# EAGLE design comms_sys_schematic_V2 (EAGLE 9.5.2)
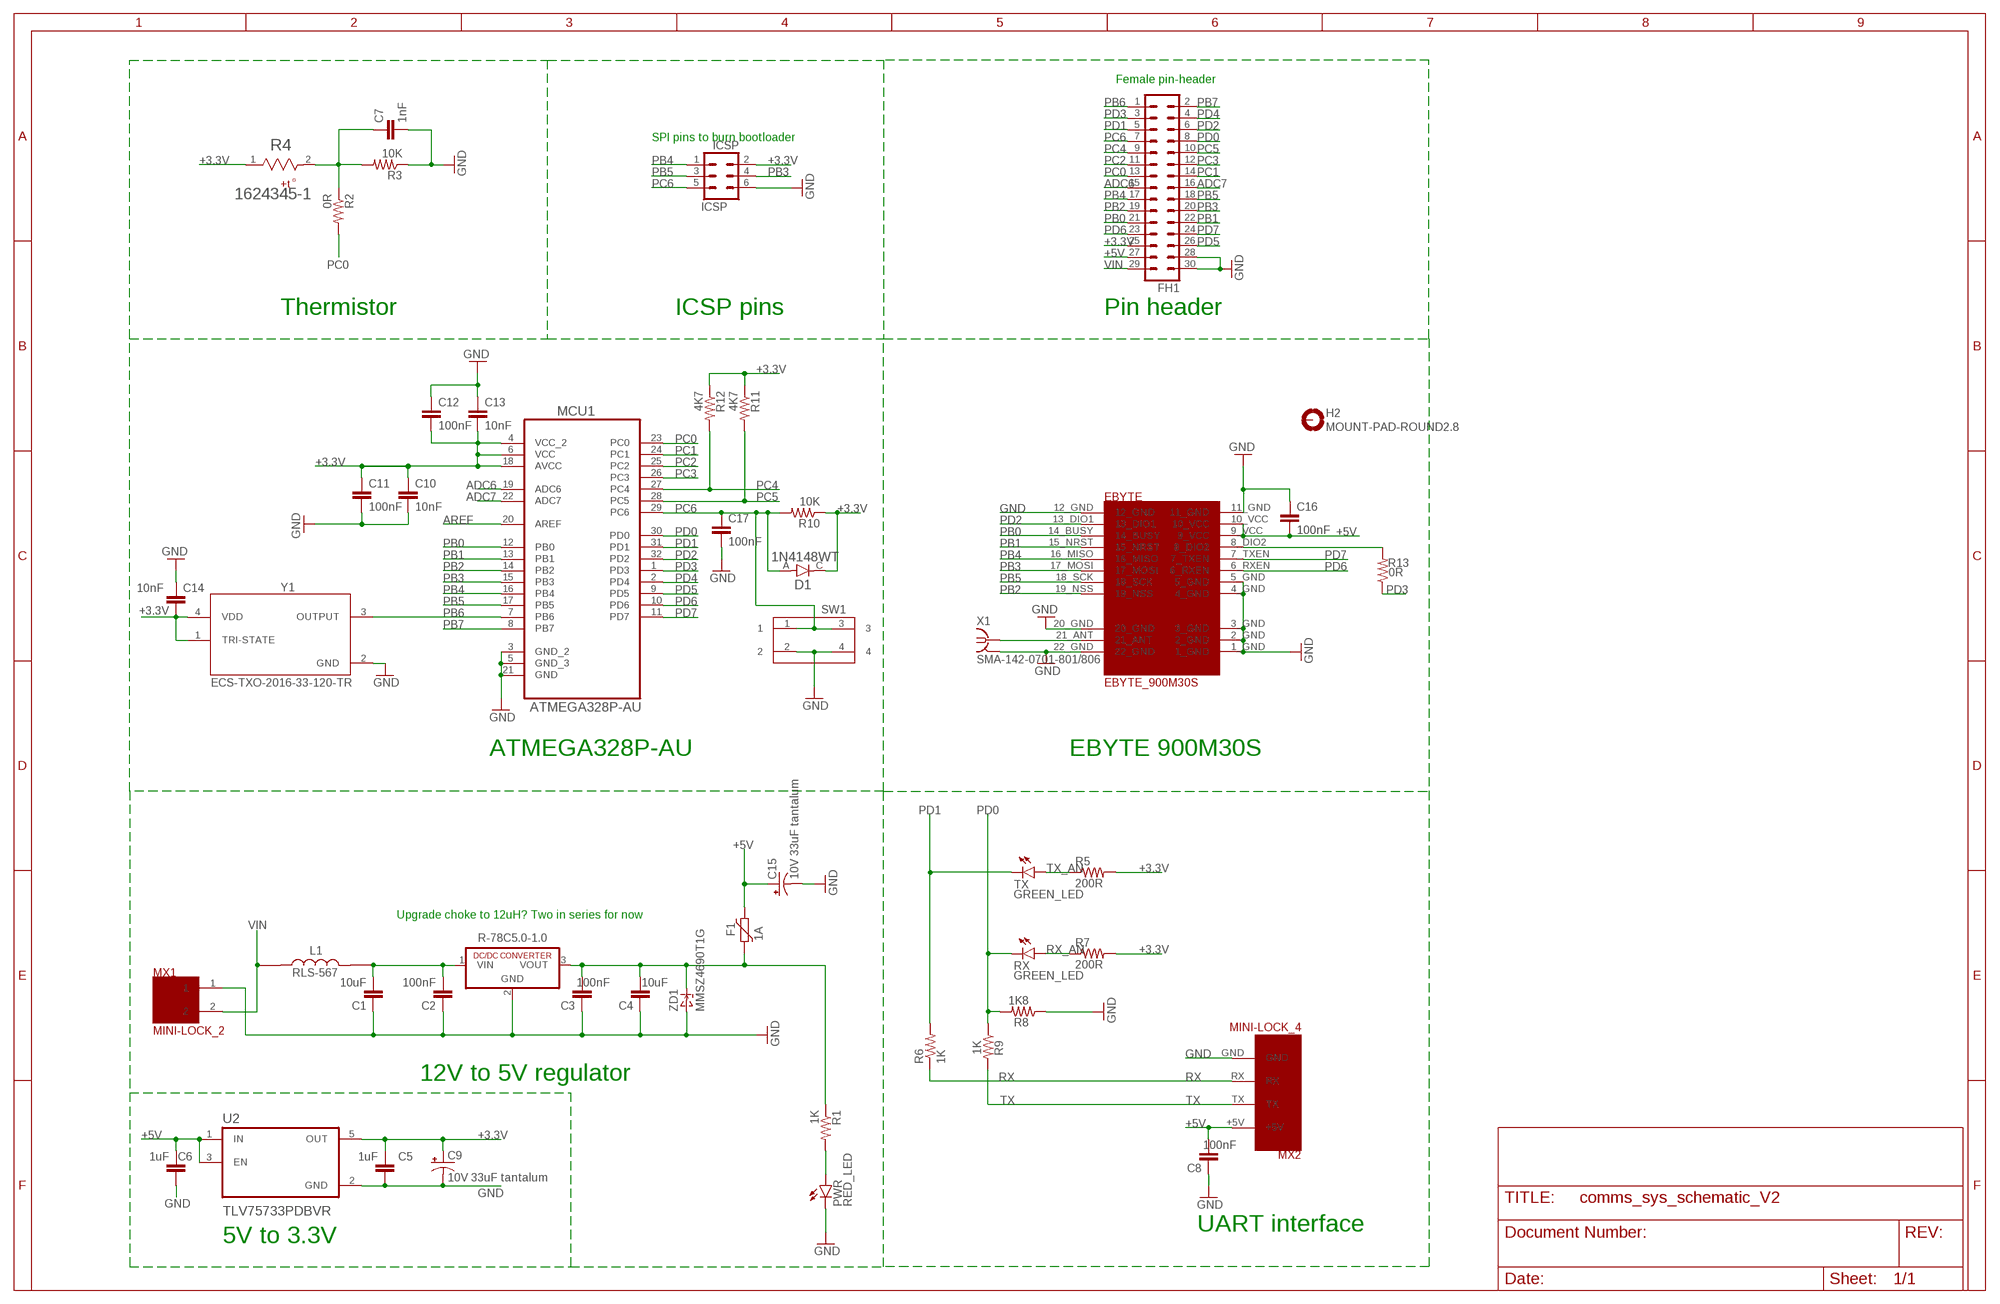
[diagram p0: schematic, sheet 1]

## Parts
C1  10uF  C-EUC0805  [C0805]
C2  100nF  C-EUC0805  [C0805]
C3  100nF  C-EUC0805  [C0805]
C4  10uF  C-EUC0805  [C0805]
C5  1uF  C-EUC0805  [C0805]
C6  1uF  C-EUC0805  [C0805]
C7  1nF  C-EUC0805  [C0805]
C8  100nF  C-EUC0805  [C0805]
C9  10V 33uF tantalum  CPOL-USCT3216  [CT3216]
C10  10nF  C-EUC0805  [C0805]
C11  100nF  C-EUC0805  [C0805]
C12  100nF  C-EUC0805  [C0805]
C13  10nF  C-EUC0805  [C0805]
C14  10nF  C-EUC0805  [C0805]
C15  10V 33uF tantalum  CPOL-USCT3216  [CT3216]
C16  100nF  C-EUC0805  [C0805]
C17  100nF  C-EUC0805  [C0805]
D1  1N4148WT  [SODFL1608X70N]
EBYTE  EBYTE_900M30S  EBYTE_SX1262_900M30S  [EBYTE_SX1262_900M30S_FOOTPRINT]
F1  1A  FUSE_PTC-0805  [PTC0805]
FH1  MA15-2  [MA15-2]
H2  MOUNT-PAD-ROUND2.8  [2,8-PAD]
ICSP  ICSP  MA03-2  [MA03-2]
L1  RLS-567  [IND_RLS-567]
MCU1  ATMEGA328P-AU  [QFP80P900X900X120-32N]
MX1  MINI-LOCK_2  [MINI-LOCK_2]
MX2  MINI-LOCK_4  [MINI-LOCK_4]
PWR  RED_LED  LEDCHIP-LED0805  [CHIP-LED0805]
R1  1K  R-US_R0805  [R0805]
R2  0R  R-US_R0805  [R0805]
R3  10K  R-US_R0805  [R0805]
R4  1624345-1  [THRMC2012X50N]
R5  200R  R-US_R0805  [R0805]
R6  1K  R-US_R0805  [R0805]
R7  200R  R-US_R0805  [R0805]
R8  1K8  R-US_R0805  [R0805]
R9  1K  R-US_R0805  [R0805]
R10  10K  R-US_R0805  [R0805]
R11  4K7  R-US_R0805  [R0805]
R12  4K7  R-US_R0805  [R0805]
R13  0R  R-US_R0805  [R0805]
RX  GREEN_LED  LEDCHIP-LED0805  [CHIP-LED0805]
SW1  430152043826  [430152043826]
TX  GREEN_LED  LEDCHIP-LED0805  [CHIP-LED0805]
U1  R-78C5.0-1.0  [SIP3]
U2  TLV75733PDBVR  [SOT95P280X145-5N]
X1  SMA-142-0701-801/806  [J502-ND-142-0701-801/806]
Y1  ECS-TXO-2016-33-120-TR  [OSC_ECS-TXO-2016-33-120-TR]
ZD1  MMSZ4690T1G  ZENERSOD-123  [SOD-123]

## Nets
$N77: C7.1 R2.1 R3.2 R4.2
+3.3V: C5.2 C9.+ C10.1 C11.1 C12.2 C13.2 C14.2 D1.C FH1.25 ICSP.2 MCU1.4(VCC_2) MCU1.6(VCC) MCU1.18(AVCC) R4.1 R5.2 R7.2 R10.1 R11.1 R12.1 U2.5(OUT) Y1.1(TRI-STATE) Y1.4(VDD)
+5V: C6.2 C8.2 C15.+ C16.2 EBYTE.9_VCC EBYTE.10_VCC F1.2 FH1.27 MX2.+5V U2.1(IN) U2.3(EN)
ADC6: FH1.15 MCU1.19(ADC6)
ADC7: FH1.16 MCU1.22(ADC7)
AREF: MCU1.20(AREF)
GND: C1.1 C2.1 C3.1 C4.1 C5.1 C6.1 C7.2 C8.1 C9.- C10.2 C11.2 C12.1 C13.1 C14.1 C15.- C16.1 C17.2 EBYTE.1_GND EBYTE.2_GND EBYTE.3_GND EBYTE.4_GND EBYTE.5_GND EBYTE.11_GND EBYTE.12_GND EBYTE.20_GND EBYTE.22_GND FH1.28 FH1.30 ICSP.6 MCU1.3(GND_2) MCU1.5(GND_3) MCU1.21(GND) MX1.1 MX2.GND PWR.C R3.1 R8.1 SW1.2 SW1.4 U1.2(GND) U2.2(GND) X1.G@1 X1.G@2 X1.G@3 X1.G@4 Y1.2(GND) ZD1.A
N$1: C3.2 C4.2 F1.1 R1.1 U1.3(VOUT) ZD1.C
N$3: EBYTE.8_DIO2 R13.2
N$4: PWR.A R1.2
N$8: EBYTE.21_ANT X1.1
N$27: C1.2 C2.2 L1.2 U1.1(VIN)
PB0: EBYTE.14_BUSY FH1.21 MCU1.12(PB0)
PB1: EBYTE.15_NRST FH1.22 MCU1.13(PB1)
PB2: EBYTE.19_NSS FH1.19 MCU1.14(PB2)
PB3: EBYTE.17_MOSI FH1.20 ICSP.4 MCU1.15(PB3)
PB4: EBYTE.16_MISO FH1.17 ICSP.1 MCU1.16(PB4)
PB5 [SCK]: EBYTE.18_SCK FH1.18 ICSP.3 MCU1.17(PB5)
PB6: FH1.1 MCU1.7(PB6) Y1.3(OUTPUT)
PB7: FH1.2 MCU1.8(PB7)
PC0: FH1.13 MCU1.23(PC0) R2.2
PC1: FH1.14 MCU1.24(PC1)
PC2: FH1.11 MCU1.25(PC2)
PC3: FH1.12 MCU1.26(PC3)
PC4: FH1.9 MCU1.27(PC4) R12.2
PC5: FH1.10 MCU1.28(PC5) R11.2
PC6: C17.1 D1.A FH1.7 ICSP.5 MCU1.29(PC6) R10.2 SW1.1 SW1.3
PD0: FH1.8 MCU1.30(PD0) R8.2 R9.1 RX.C
PD1: FH1.5 MCU1.31(PD1) R6.2 TX.C
PD2: EBYTE.13_DIO1 FH1.6 MCU1.32(PD2)
PD3: FH1.3 MCU1.1(PD3) R13.1
PD4: FH1.4 MCU1.2(PD4)
PD5: FH1.26 MCU1.9(PD5)
PD6: EBYTE.6_RXEN FH1.23 MCU1.10(PD6)
PD7: EBYTE.7_TXEN FH1.24 MCU1.11(PD7)
RX: MX2.RX R6.1
RX_AN: R7.1 RX.A
TX: MX2.TX R9.2
TX_AN: R5.1 TX.A
VIN: FH1.29 L1.1 MX1.2
Unconnected: H2.B2,8(MOUNT)

## Notes on the sheet
- Female pin-header
- SPI pins to burn bootloader
- Thermistor | ICSP pins | Pin header
- ATMEGA328P-AU | EBYTE 900M30S
- Upgrade choke to 12uH? Two in series for now
- 12V to 5V regulator
- UART interface
- 5V to 3.3V

## Library data of the parts
C1-C8 C10-C14 C16 C17 = rcl:C-EU: CAPACITOR, European symbol; SPICEPREFIX: C
C9 C15 = rcl:CPOL-US: POLARIZED CAPACITOR, American symbol; SPICEPREFIX: C
D1 = 1N4148WT:1N4148WT: Diode Switching 100V 0.125A 2-Pin SOD-523; DESCRIPTION: Diode Standard 75V 200mA Surface Mount SOD-523F; DIGI-KEY_PART_NUMBER: 1N4148WTCT-ND; MF: ON Semiconductor; MP: 1N4148WT; PACKAGE: SOD-523-2 ON Semiconductor; PURCHASE-URL: https://pricing.snapeda.com/search/part/1N4148WT/?ref=eda
EBYTE = cust_parts:EBYTE_SX1262_900M30S
F1 = dp_devices.v6:FUSE_PTC: Resettable PTC
FH1 = con-lstb:MA15-2: PIN HEADER
H2 = holes:MOUNT-PAD-ROUND: MOUNTING PAD, round
ICSP = con-lstb:MA03-2: PIN HEADER; OC_FARNELL: unknown; OC_NEWARK: unknown
L1 = RLS-567:RLS-567: Line Inductors for RECOM Power Supply; AVAILABILITY: Unavailable; DESCRIPTION: Line Inductors for RECOM Power Supply; DIGIKEY-PURCHASE-URL: https://snapeda.com/shop?store=DigiKey&id=3641543; MF: Recom Power; MP: RLS-567; PACKAGE: 1812 Recom Power; PRICE: None
MCU1 = Atmel_By_element14_Batch_1-00:ATMEGA328P-AU: 8-bit Microcontroller with In-System Programmable Flash; MPN: ATMEGA328P-AU; OC_FARNELL: 1715486; OC_NEWARK: 14R4631; PACKAGE: TQFP-32; SUPPLIER: Atmel
MX1 = cust_parts:MINI-LOCK_2
MX2 = cust_parts:MINI-LOCK_4
PWR RX TX = led:LED: LED OSRAM: - CHIPLED LG R971, LG N971, LY N971, LG Q971, LY Q971, LO R971, LY R971 LH N974, LH R974 LS Q976, LO Q976, LY Q976 LO Q996 - Hyper CHIPLED LW Q18S LB Q993, LB Q99A, LB R99A - SideLED LS A670, LO A670, LY A670, LG A670, LP A670 LB A673, LV A673, LT A673, LW A673 LH A674 LY A675 LS A676, LA A676, LO A676, LY A676, LW A676 LS A679, LY A679, LG A679 - Hyper Micro SIDELED® LS Y876, LA Y876, LO Y876, LY Y876 LT Y87S - SmartLED LW L88C, LW L88S LB L89C, LB L89S, LG L890 LS L89K, LO L89K, LY L89K LS L896, LA L896, LO L896, LY L896 - TOPLED LS T670, LO T670, LY T670, LG T670, LP T670 LSG T670, LSP T670, LSY T670, LOP T670, LYG T670 LG T671, LOG T671, LSG T671 LB T673, LV T673, LT T673, LW T673 LH T674 LS T676, LA T676, LO T676, LY T676, LB T676, LH T676, LSB T676, LW T676 LB T67C, LV T67C, LT T67C, LS T67K, LO T67K, LY T67K, LW E67C LS E67B, LA E67B, LO E67B, LY E67B, LB E67C, LV E67C, LT E67C LW T67C LS T679, LY T679, LG T679 LS T770, LO T770, LY T770, LG T770, LP T770 LB T773, LV T773, LT T773, LW T773 LH T774 LS E675, LA E675, LY E675, LS T675 LS T776, LA T776, LO T776, LY T776, LB T776 LHGB T686 LT T68C, LB T68C - Hyper Mini TOPLED® LB M676 - Mini TOPLED Santana® LG M470 LS M47K, LO M47K, LY M47K Source: http://www.osram.convergy.de LUXEON: - LUMILED® LXK2-PW12-R00, LXK2-PW12-S00, LXK2-PW14-U00, LXK2-PW14-V00 LXK2-PM12-R00, LXK2-PM12-S00, LXK2-PM14-U00 LXK2-PE12-Q00, LXK2-PE12-R00, LXK2-PE12-S00, LXK2-PE14-T00, LXK2-PE14-U00 LXK2-PB12-K00, LXK2-PB12-L00, LXK2-PB12-M00, LXK2-PB14-N00, LXK2-PB14-P00, LXK2-PB14-Q00 LXK2-PR12-L00, LXK2-PR12-M00, LXK2-PR14-Q00, LXK2-PR14-R00 LXK2-PD12-Q00, LXK2-PD12-R00, LXK2-PD12-S00 LXK2-PH12-R00, LXK2-PH12-S00 LXK2-PL12-P00, LXK2-PL12-Q00, LXK2-PL12-R00 Source: www.luxeon.com KINGBRIGHT: KA-3528ASYC Source: www.kingbright.com
R1-R3 R5-R13 = rcl:R-US_: RESISTOR, American symbol; SPICEPREFIX: R
R4 = 1624345-1:1624345-1: NTC0805 5% 10K; COMMENT: 1624345-1; DESCRIPTION: Thermistor NTC 10K Ohm 5% 2-Pin 0805 Surface Mount Solder Pad 4100K T/R; DIGI-KEY_PART_NUMBER: A106104CT-ND; MF: TE Connectivity; MP: NTC0805J10K; PACKAGE: 0805 TE Connectivity; PURCHASE-URL: https://pricing.snapeda.com/search/part/NTC0805J10K/?ref=eda
SW1 = Wurth_Elektronik_Electromechanic_Switch_rev16c:430152043826: 6x6 mm SMD WS-TASV <http://katalog.we-online.de/media/images/v2/Family_WS-TASV_6x6mm_SMD_Tact_Switch_4301820xx8xx.jpg> Details see: http://katalog.we-online.de/en/em/TASV_6X6_SMD 2015 (C) Würth Elektronik
U1 = dc-dc-converter:R-78C*-1.0: INNOLINE DC/DC-Converter 1.0 AMP SIP3 Single Output Source: Data sheet <http://www.mikrocontroller.net/attachment/150645/157764-da-01-en-DC_DC_WANDLER_R_78C5_0_1_0.pdf>
U2 = TLV75733PDBVR:TLV75733PDBVR; DESCRIPTION: 1-A, low-IQ, high-accuracy, low-dropout voltage regulator with enable 5-SOT-23 -40 to 125; DIGI-KEY_PART_NUMBER: 296-50414-1-ND; MF: Texas Instruments; MP: TLV75733PDBVR; PACKAGE: SOT-23-5 Texas Instruments; PURCHASE-URL: https://pricing.snapeda.com/search/part/TLV75733PDBVR/?ref=eda
X1 = con-coax:SMA-: SMA 50 Ohm End Launch Jack Receptacle - Round Contact Johnson Components Source: www.johnsoncomponents.com .. J502-ND.pdf; MF: JOHNSON COMPONENTS; MPN: 142-0701-801; OC_FARNELL: 1608592; OC_NEWARK: 90F2624
Y1 = ECS-TXO-2016-33-120-TR:ECS-TXO-2016-33-120-TR; DESCRIPTION: Oscillator TCXO 12MHz ±2ppm (Tol) ±2.5ppm (Stability) 15pF HCMOS 55% 3.3V 4-Pin Mini-CSMD T/R; DIGI-KEY_PART_NUMBER: XC3160CT-ND; MF: ECS Inc.; MP: ECS-TXO-2016-33-120-TR; PACKAGE: None; PURCHASE-URL: https://pricing.snapeda.com/search/part/ECS-TXO-2016-33-120-TR/?ref=eda
ZD1 = dp_devices.v6:ZENER: Zener Diode SOD-323

## Board
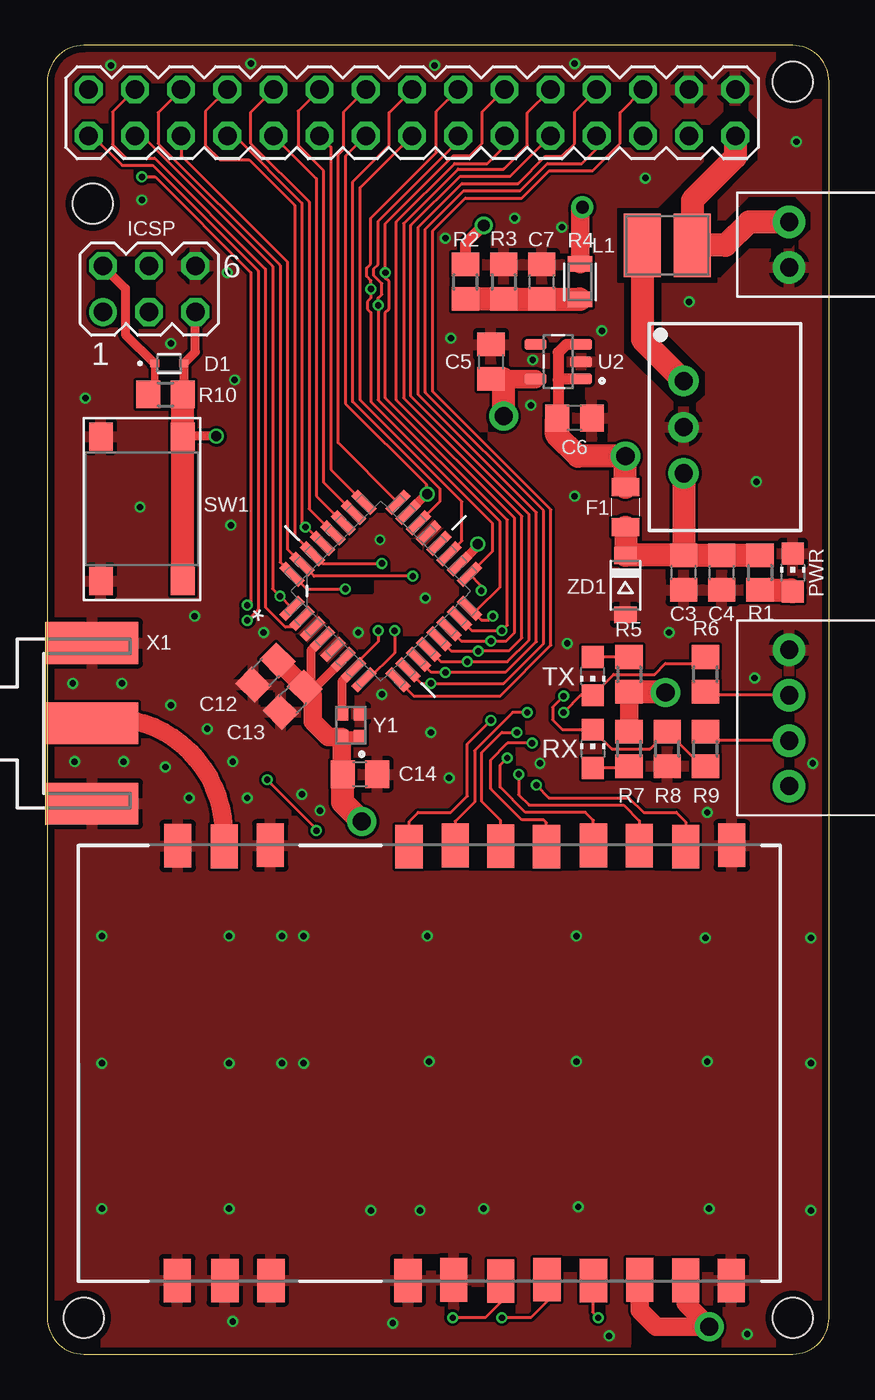
[diagram p1: board, top side]
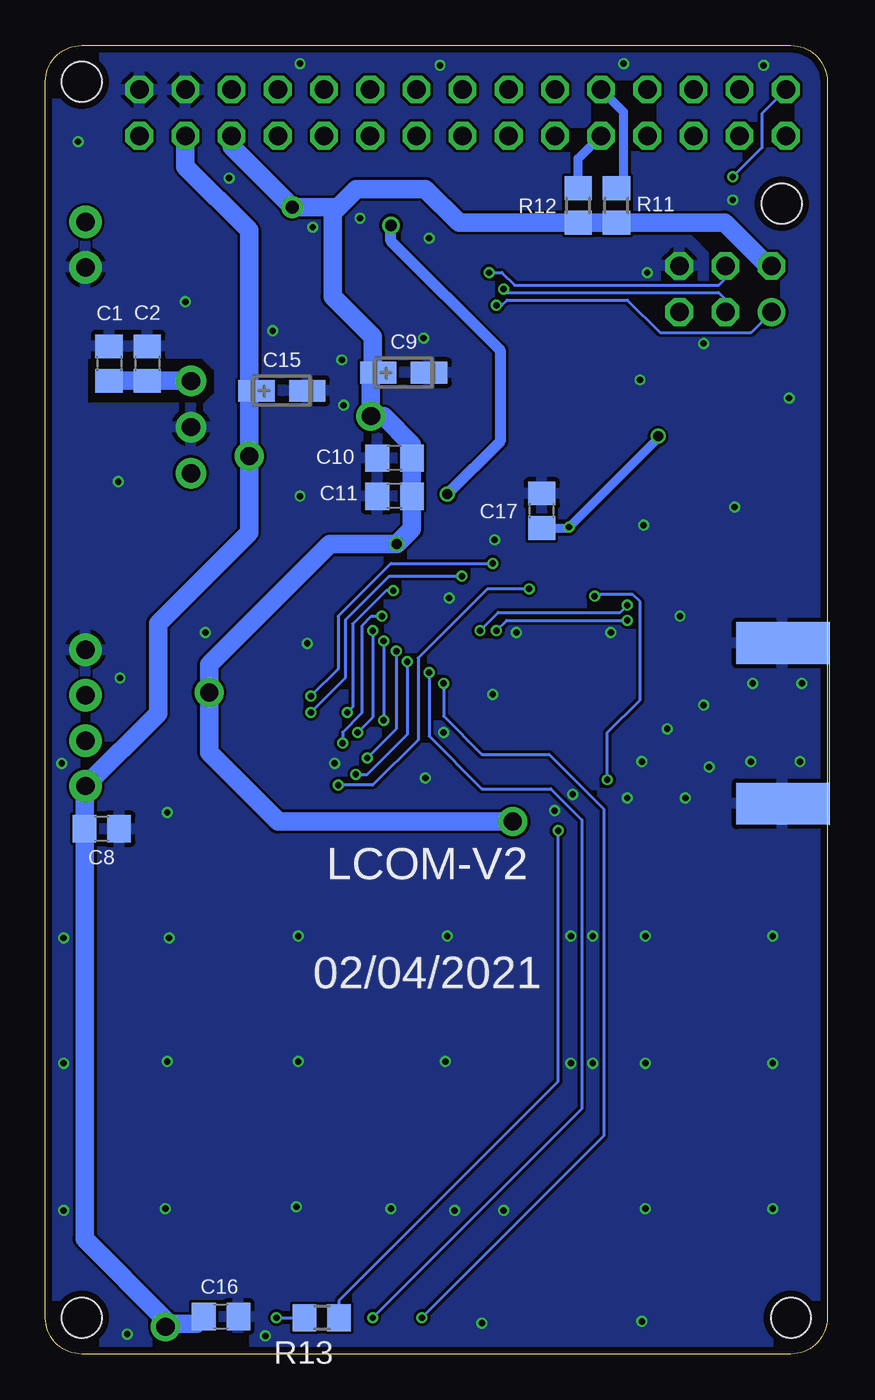
[diagram p2: board, bottom side, seen from below]

Size 43 x 72 mm. Coordinates in mm from the lower left corner, seen from the top.
Outline: 41,72 2,72 arc90 0,70 0,2 arc90 2,0 41,0 arc90 43,2 43,70 arc90 41,72
Copper layers (1*16): Top 0.035559375mm / dielectric 1.6mm / Bottom 0.035559375mm
Design rules "oshpark-2layer *": minimum track width 6mil, minimum drill 10mil, track to track 6mil, track to pad 6mil, pad to pad 6mil, via to via 6mil, smd to smd 6mil, copper to edge 15mil, drill to drill 6mil, minimum pad ring 5mil, minimum via ring 5mil, stop-mask expansion 2.5mil, vias tented up to drill 0mil, thermal gap 10mil
Holes 2.2 mm at 41,2 2,2 2.5,63.3 41,70

### Footprints (pad centres in the part's own frame; a part is rotated, then mirrored left to right if it is on the bottom)
C0805 = smd 1.3 x 1.5: 1 -0.95,0; 2 0.95,0
CT3216 = smd 2 x 1.2: + -1.4,0; - 1.4,0
SODFL1608X70N = smd 0.53 x 0.4: A 0.8,0; C -0.8,0
EBYTE_SX1262_900M30S_FOOTPRINT = smd 2.4 x 1.5: 1_GND 11.946,-13.848; 2_GND 11.953,-11.232; 3_GND 11.946,-8.7; 4_GND 11.946,-1.155; 5_GND 11.915,1.361; 6_RXEN 11.984,3.939; 7_TXEN 11.907,6.479; 8_DIO2 11.953,9.049; 9_VCC 11.915,11.589; 10_VCC 11.938,14.113; 11_GND 11.946,16.622; 12_GND -11.991,16.645; 13_DIO1 -11.917,14.112; 14_BUSY -11.965,11.563; 15_NRST -11.986,9.038; 16_MISO -11.914,6.456; 17_MOSI -11.937,3.938; 18_SCK -11.986,1.435; 19_NSS -11.907,-1.1; 20_GND -11.992,-8.731; 21_ANT -11.93,-11.263; 22_GND -11.961,-13.818
PTC0805 = smd 1 x 1.5: 1 -1.1,0; 2 1.1,0
MA15-2 = drill 1.016 octagon: 1 -20.32,-1.27; 2 -20.32,1.27; 3 -17.78,-1.27; 4 -17.78,1.27; 5 -15.24,-1.27; 6 -15.24,1.27; 7 -12.7,-1.27; 8 -12.7,1.27; 9 -10.16,-1.27; 10 -10.16,1.27; 11 -7.62,-1.27; 12 -7.62,1.27; 13 -5.08,-1.27; 14 -5.08,1.27; 15 -2.54,-1.27; 16 -2.54,1.27; 17 0,-1.27; 18 0,1.27; 19 2.54,-1.27; 20 2.54,1.27; 21 5.08,-1.27; 22 5.08,1.27; 23 7.62,-1.27; 24 7.62,1.27; 25 10.16,-1.27; 26 10.16,1.27; 27 12.7,-1.27; 28 12.7,1.27; 29 15.24,-1.27; 30 15.24,1.27
2,8-PAD = drill 2.8 pad 5.334: B2,8 0,0
MA03-2 = drill 1.016: 1 -2.54,-1.27 | drill 1.016 octagon: 2 -2.54,1.27; 3 0,-1.27; 4 0,1.27; 5 2.54,-1.27; 6 2.54,1.27
IND_RLS-567 = smd 2.05 x 3.5: 1 -1.375,0; 2 1.375,0
QFP80P900X900X120-32N = smd 1.473 x 0.508: 1 -4.115,2.794; 2 -4.115,2.007; 3 -4.115,1.194; 4 -4.115,0.406; 5 -4.115,-0.406; 6 -4.115,-1.194; 7 -4.115,-2.007; 8 -4.115,-2.794; 17 4.115,-2.794; 18 4.115,-2.007; 19 4.115,-1.194; 20 4.115,-0.406; 21 4.115,0.406; 22 4.115,1.194; 23 4.115,2.007; 24 4.115,2.794 | smd 0.508 x 1.473: 9 -2.794,-4.115; 10 -2.007,-4.115; 11 -1.194,-4.115; 12 -0.406,-4.115; 13 0.406,-4.115; 14 1.194,-4.115; 15 2.007,-4.115; 16 2.794,-4.115; 25 2.794,4.115; 26 2.007,4.115; 27 1.194,4.115; 28 0.406,4.115; 29 -0.406,4.115; 30 -1.194,4.115; 31 -2.007,4.115; 32 -2.794,4.115
MINI-LOCK_2 = drill 1 pad 1.778: 1 0,1.21; 2 0,-1.29
MINI-LOCK_4 = drill 1 pad 1.778: +5V 0,3.75; GND 0,-3.75; RX 0,-1.25; TX 0,1.25
CHIP-LED0805 = smd 1.2 x 1.2: A 0,-1.05; C 0,1.05
R0805 = smd 1.3 x 1.5: 1 -0.95,0; 2 0.95,0
THRMC2012X50N = smd 0.86 x 1.36: 1 -0.975,0; 2 0.975,0
430152043826 = smd 1.55 x 1.3: 1 -3.975,2.25; 2 -3.975,-2.25; 3 3.975,2.25; 4 3.975,-2.25
SIP3 = drill 1 pad 1.676: 1 -2.54,0; 2 0,0; 3 2.54,0
SOT95P280X145-5N = smd 1.21 x 0.59: 1 -1.255,0.95; 2 -1.255,0; 3 -1.255,-0.95; 4 1.255,-0.95; 5 1.255,0.95
J502-ND-142-0701-801/806 = smd 5.08 x 2.286: 1 2.565,0; G@1 2.565,4.42; G@2 2.565,-4.42 | smd 5.08 x 2.286 bottom: G@3 2.565,4.42; G@4 2.565,-4.42
OSC_ECS-TXO-2016-33-120-TR = smd 0.8 x 0.7: 1 -0.65,-0.5; 2 0.65,-0.5; 3 0.65,0.5; 4 -0.65,0.5
SOD-123 = smd 0.91 x 1.22: A 1.635,0; C -1.635,0

### Placement (x,y rotation side)
C1  39.5,54.5 270 bottom
C2  37.4,54.5 270 bottom
C3  35,43 90 top
C4  37.1,43 90 top
C5  24.4,54.6 270 top
C6  29,51.5 180 top
C7  27.2,59 90 top
C8  39.9,28.9 180 bottom
C9  23.3,54 0 bottom
C10  23.8,49.3 180 bottom
C11  23.8,47.2 180 bottom
C12  12,37.5 45 top
C13  13.5,36 45 top
C14  17.2,31.9 180 top
C15  30,53 0 bottom
C16  33.34,2.06 180 bottom
C17  15.7,46.4 90 bottom
D1  6.7,54.5 0 top
EBYTE  21,16 270 top
F1  31.8,46.6 90 top
FH1  22.6,68.3 0 top
H2  -9,-25 0 top  (outside the outline)
ICSP  5.6,58.6 0 top
L1  34.1,61 180 top
MCU1  18.34,41.98 45 top
MX1  40.8,61 180 top
MX2  40.8,35 180 top
PWR  41,43 0 top
R1  39.2,43 270 top
R2  23,59 90 top
R3  25.1,59 270 top
R4  29.3,59 270 top
R5  32,37.4 270 top
R6  36.2,37.4 90 top
R7  32,33.3 90 top
R8  34.1,33.3 90 top
R9  36.2,33.3 90 top
R10  6.5,52.8 0 top
R11  11.6,63.2 90 bottom
R12  13.7,63.2 90 bottom
R13  27.8,2 180 bottom
RX  30,33.3 0 top
SW1  5.2,46.5 270 top
TX  30,37.3 180 top
U1  35,51 270 top
U2  28.1,54.6 180 top
X1  -0.1,34.7 0 top
Y1  16.7,34.6 90 top
ZD1  31.8,42.3 270 top

### Tracks (layer width: path | path; a pad name or v marks a point on that pad's centre or on a via)
$N77
  Top 1.27: R2.1 R3.2 C7.1 29.27,58.05 R4.2
+3.3V  (via drill 0.55, 0.7 pad 1.2, 1 pad 1.6)
  Top 0.406: D1.C 5.9,53.15 R10.1
  Top 0.508: v23.67,44.56 23.67,44.46 MCU1.18 | ICSP.2 4.3,58.63 4.3,56.1 D1.C | MCU1.6 14.73,36.67 14.5,36.67 | 14.5,36.67 C13.2 | MCU1.4 14.5,38.71 14.5,36.67
  Top 0.61: Y1.1 Y1.4
  Top 1.016: R5.2 R7.2 | U2.5 25.1,53.65 C5.2 | C12.2 C13.2 14.6,36.24 14.6,34.8 15.45,33.95 Y1.4 16.2,31.95 C14.2 | v29.43,63.1 29.3,62.97 R4.1
  Top 1.27: v25.1,51.6 25.1,53.65 | R5.2 33.95,36.45 v34,36.4 | v17.3,29.3 16.25,30.35 C14.2
  Bottom 1.016: v17.3,29.3 30.2,29.3 34,33.1 v34,36.4 34,37.93 27.37,44.56 v23.67,44.56 22.85,45.38 C11.1 C10.1 22.85,50.05 24.4,51.6 v25.1,51.6 25.1,53.6 25,53.7 | ICSP.2 3.26,59.87 5.64,62.25 R11.1 R12.1 20.25,62.25 22.1,64.1 25.9,64.1 26.9,63.1 | 26.9,63.1 27.2,62.8 27.2,58.17 25,55.97 25,53.7 | FH1.25 32.76,66.43 v29.43,63.1 26.9,63.1 | 25,53.7 C9.+
+5V  (via drill 1 pad 1.6)
  Top 0.61: U2.3 28.55,55.55 28.1,55.1 28.1,53.6 | C6.2 28.1,51.55 28.1,53.6 | U2.1 28.15,53.65 28.1,53.6
  Top 1.016: EBYTE.10_VCC 35.11,2.79 v36.4,1.5 33.5,1.5 32.59,2.41 EBYTE.9_VCC
  Top 1.27: F1.2 v31.8,49.4 29.2,49.4 28,50.6 28,51.45 C6.2
  Bottom 1.016: C16.2 34.69,1.66 36.24,1.66 v36.4,1.5 36.4,1.9 40.85,6.35 C8.2 40.85,31.2 MX2.+5V 36.8,35.25 36.8,40.2 31.8,45.2 v31.8,49.4 31.8,52.6 | FH1.27 35.3,65.33 31.8,61.83 31.8,52.6 | 31.8,52.6 C15.+
ADC6
  Top 0.152: MCU1.19 22.8,44.74 22.8,46.9 17.2,52.49 17.2,64.17 FH1.15
ADC7
  Top 0.152: MCU1.22 21.6,46.92 21.6,47.6 16.8,52.4 16.8,64.5 18.8,66.5 18.8,68.31 FH1.16
GND  (via drill 0.35)
  other vias: 18.3,44.8 20.8,41.6 10,23 36.2,22.9 36.4,8 10,8 24,8 20.9,23 21,16.1 36.3,16.1 10,16 17.8,7.9 20.5,7.9 27.1,32.5 39,48 35.3,57.9 10.3,53.6 2.1,52.6 10.1,45.6 34.2,39.7 41.2,66.7 28.6,39.1 38.5,1.1 42,16 42,22.9 42,7.9 3.5,70.9 11.2,71 5.2,63.5 6.8,55.6 10.2,1.8 30.9,1 12.9,16 12.9,23 36.3,29.8 14,30.8 22.2,55.9 26.6,52.2 30.5,56.3 29,47.2 18.4,36.3 17.1,39.7 6.5,32.3 7.8,30.6 11,30.6 10.2,32.6 8.8,34.4 6.8,35.7 4.1,36.9 4.2,32.6 1.4,36.9 1.5,32.6 5.1,46.6 11.9,39.7 21.1,34.2 21.3,70.9 29,71 38.9,37.2 32.9,64.7 9.9,59.5 25.7,62.5 21.9,61.4 42.1,32.5 29.1,23 29.1,16.1 29.2,8.1 3,8 3,16 3,23 14.1,23 14.1,16 8.1,40.6 26.7,54.7 15,29.9 28.3,62 22.1,31.7 19,1.7
  pour Top: -10,78 54,78 58,74 58,1 48,-9 -6,-9 -11,-4 -11,77
  pour Bottom: -13,81 52,81 61,72 61,1 47,-13 -9,-13 -10,-12 -13,-9
N$1
  Top 1.016: 31.82,43.95 ZD1.C
  Top 1.27: C3.2 C4.2 R1.1 | C3.2 31.82,43.95 31.82,45.48 F1.1 | U1.3 C3.2
N$3  (via drill 0.35)
  Top 0.152: EBYTE.8_DIO2 30,4 30,2.3 v30.3,2
  Bottom 0.152: v30.3,2 R13.2
N$4
  Top 1.27: R1.2 40.9,42.05 PWR.A
N$8
  Top 1.016: EBYTE.21_ANT 9.7,28.9 arc70 5.3,34.7 arc36 X1.1
N$27
  Top 1.27: 32.85,60.88 L1.2 32.73,55.81 U1.1
  Bottom 1.016: U1.1 C2.2 C1.2
NO_GND
  cutout Top (isolate 0.254, no thermals): 29.5,52.5 29.5,53.1 28.6,53.1 28.6,52.4 29.5,52.4
  cutout Top (isolate 0.254, no thermals): 5.9,58.3 5.9,58.9 5,58.9 5,58.2 5.9,58.2
  cutout Top (isolate 0.254, no thermals): 4.8,59.7 4.8,60.3 3.9,60.3 3.9,59.6 4.8,59.6
  cutout Top (isolate 0.254, no thermals): 6.5,69.2 6.5,69.8 5.6,69.8 5.6,69.1 6.5,69.1
  cutout Top (isolate 0.254, no thermals): 9.1,69.3 9.1,69.9 8.2,69.9 8.2,69.2 9.1,69.2
  cutout Top (isolate 0.254, no thermals): 11.6,69.3 11.6,69.9 10.7,69.9 10.7,69.2 11.6,69.2
  cutout Top (isolate 0.254, no thermals): 14.2,69.3 14.2,69.9 13.3,69.9 13.3,69.2 14.2,69.2
  cutout Top (isolate 0.254, no thermals): 16.7,69.3 16.7,69.9 15.8,69.9 15.8,69.3
  cutout Top (isolate 0.254, no thermals): 19.2,69.3 19.2,69.9 18.3,69.9 18.3,69.2 19.2,69.2
  cutout Top (isolate 0.254, no thermals): 21.7,69.3 21.7,69.9 20.8,69.9 20.8,69.2 21.7,69.2
  cutout Top (isolate 0.254, no thermals): 24.3,69.3 24.3,69.9 23.4,69.9 23.4,69.2 24.3,69.2
  cutout Top (isolate 0.254, no thermals): 26.9,69.3 26.9,69.9 26,69.9 26,69.2 26.9,69.2
  cutout Top (isolate 0.254, no thermals): 29.4,69.3 29.4,69.9 28.5,69.9 28.5,69.2 29.4,69.2
  cutout Top (isolate 0.254, no thermals): 31.9,69.3 31.9,69.9 31,69.9 31,69.2 31.9,69.2
  cutout Top (isolate 0.254, no thermals): 33.1,68 33.1,68.6 32.2,68.6 32.2,67.9 33.1,67.9
  cutout Top (isolate 0.254, no thermals): 31.8,26.8 31.8,27.4 30.9,27.4 30.9,26.7 31.8,26.7
  cutout Top (isolate 0.254, no thermals): 29.2,26.8 29.2,27.4 28.3,27.4 28.3,26.7 29.2,26.7
  cutout Top (isolate 0.254, no thermals): 26.7,26.7 26.7,27.5 25.8,27.5 25.8,26.7
  cutout Top (isolate 0.254, no thermals): 24.1,26.8 24.1,27.4 23.2,27.4 23.2,26.7 24.1,26.7
  cutout Top (isolate 0.254, no thermals): 21.6,26.8 21.6,27.4 20.7,27.4 20.7,26.7 21.6,26.7
  cutout Top (isolate 0.254, no thermals): 21.6,26.8 21.6,27.4 20.7,27.4 20.7,26.7 21.6,26.7
  cutout Top (isolate 0.254, no thermals): 34.3,26.8 34.3,27.4 33.4,27.4 33.4,26.7 34.3,26.7
  cutout Top (isolate 0.254, no thermals): 21.5,4.7 21.5,5.4 20.8,5.4 20.8,4.7
  cutout Top (isolate 0.254, no thermals): 24,2.9 24,3.6 23.3,3.6 23.3,2.9
  cutout Top (isolate 0.254, no thermals): 29.1,4.6 29.1,5.3 28.4,5.3 28.4,4.6
  cutout Top (isolate 0.254, no thermals): 34.2,4.6 34.2,5.3 33.5,5.3 33.5,4.6
  cutout Top (isolate 0.254, no thermals): 36.7,4.6 36.7,5.3 36,5.3 36,4.6
  cutout Top (isolate 0.254, no thermals): 21.35,46.05 21.85,45.55 22.1,45.8 22.1,46 21.8,46.3 21.6,46.3
  cutout Bottom (isolate 0.254, no thermals): 6.4,60.6 7.35,61.55 7.3,61.6 5.9,61.6 5.9,61.1
  cutout Bottom (isolate 0.254, no thermals): 2.7,59 2.7,58.2 3.6,58.2 3.6,59
  cutout Top (isolate 0.254, no thermals): 3.6,58.3 3.6,58.9 2.7,58.9 2.7,58.2 3.6,58.2
  cutout Top (isolate 0.254, no thermals): 24.3,60.8 24.3,61.5 23.7,61.5 23.7,60.8
  cutout Top (isolate 0.254, no thermals): 30.1,58.7 30.1,59.4 29.5,59.4 29.5,58.7
  cutout Bottom (isolate 0.254, no thermals): 1.9,68.7 1.9,67.9 2.8,67.9 2.8,68.7
  cutout Bottom (isolate 0.254, no thermals): 1.9,68.7 1.9,67.9 2.8,67.9 2.8,68.7
  cutout Bottom (isolate 0.254, no thermals): 9.5,68.6 9.5,67.8 10.4,67.8 10.4,68.6
  cutout Bottom (isolate 0.254, no thermals): 12,68.7 12,67.9 12.9,67.9 12.9,68.7
  cutout Bottom (isolate 0.254, no thermals): 10.7,70 10.7,69.2 11.6,69.2 11.6,70
  cutout Bottom (isolate 0.254, no thermals): 13.3,67.4 13.3,66.6 14.2,66.6 14.2,67.4
  cutout Bottom (isolate 0.254, no thermals): 31.9,1.1 31.9,0.3 32.8,0.3 32.8,1.1
  cutout Top (isolate 0.254, no thermals): 32.9,0.5 32.9,1.7 32.2,1.7 32.2,0.5
  cutout Top (isolate 0.254, no thermals): 7.1,54.2 7.1,54.8 6.2,54.8 6.2,54.1 7.1,54.1
  cutout Top (isolate 0.254, no thermals): 17.9,41.9 17.9,42.6 17.2,42.6 17.2,41.9
  cutout Top (isolate 0.254, no thermals): 20.3,38.9 20.3,39.4 19.4,39.4 19.4,38.9
  cutout Top: 31.4,63 36.8,63 36.8,59 31.4,59
  cutout Top: 33.6,63 36.2,65.6 36.2,67.3 37.5,68.6 38.3,68.6 39,67.9 39,65.7 36.3,63
  cutout Top: 37,62 38.6,63.6 41.1,63.6 41.9,62.8 41.9,61.9 40.9,60.9 38.6,60.9 37,59.3
  cutout Top: 31.8,59 31.8,55.1 34.7,52.2 35.5,52.2 36.1,52.8 36.1,54 33.7,56.4 33.7,59
  cutout Bottom: 34.4,54.7 40.6,54.7 40.6,52.4 34.3,52.4 33.8,52.9 33.8,54.1
PB0  (via drill 0.35)
  Top 0.152: MCU1.12 21.64,38.1 v23.1,38.1 25.3,38.1 26.5,39.3 26.5,46.2 20,52.7 20,62.1 22.7,64.8 25.45,64.8 FH1.21 | EBYTE.14_BUSY 32.56,29.34 31.7,30.2 26.5,30.2 25.93,30.77 v25.93,31.9
  Bottom 0.152: v25.93,31.9 25.3,31.9 23.1,34.1 v23.1,38.1
PB1  (via drill 0.35)
  Top 0.152: MCU1.13 22.23,38.67 v23.7,38.67 23.73,38.7 25.4,38.7 26.1,39.4 26.1,46.1 19.6,52.6 19.6,62.2 22.59,65.19 25.09,65.19 26.4,66.5 26.4,68.29 FH1.22 | EBYTE.15_NRST 30.04,29.36 29.6,29.8 26.3,29.8 24.9,31.2 24.9,32.4 v25.3,32.8
  Bottom 0.152: v25.3,32.8 23.7,34.4 v23.7,38.67
PB2  (via drill 0.35)
  Top 0.152: MCU1.14 22.78,39.23 v24.4,39.23 25.23,39.23 25.7,39.7 25.7,46 19.2,52.5 19.2,62.3 22.4,65.5 24.2,65.5 25.14,66.44 FH1.19 | v24.4,34.87 23.1,33.57 23.1,30.7 22.2,29.8 20.4,29.8 19.9,29.3 EBYTE.19_NSS
  Bottom 0.152: v24.4,39.23 v24.4,34.87
PB3  (via drill 0.35)
  Top 0.152: MCU1.15 23.36,39.8 v25,39.8 25.3,40.1 25.3,45.9 18.6,52.6 18.6,57.3 18.8,57.5 18.8,59.03 18.6,59.23 v18.6,59.5 18.6,62.2 22.3,65.9 23.2,65.9 23.9,66.6 23.9,68.33 FH1.20 | v25.83,34.2 25,34.2 23.9,33.1 23.9,30.4 24.94,29.36 EBYTE.17_MOSI
  Bottom 0.152: v25,39.8 25,35.03 v25.83,34.2 | v18.6,59.5 17.9,59.5 17.2,58.8 5.97,58.8 5.6,59.17 ICSP.4
PB4  (via drill 0.35)
  Top 0.152: FH1.17 22.6,66.73 18.2,62.33 18.2,59.95 17.97,59.72 17.97,59.33 18.4,58.9 18.4,58.3 18.2,58.1 v18.2,57.7 18.2,52.5 24.9,45.8 24.9,42.21 23.63,40.94 23.33,40.94 MCU1.16 23.87,40.4 24.3,40.4 v24.5,40.6 | v26.66,33.61 25.31,33.61 24.4,32.7 24.4,31.1 26.1,29.4 27.3,29.4 27.46,29.24 EBYTE.16_MISO
  Bottom 0.152: v26.66,33.61 26.66,34.21 25.6,35.27 25.6,40.07 25.07,40.6 v24.5,40.6 | ICSP.1 4.19,56.2 9.2,56.2 10.99,57.99 17.61,57.99 17.9,57.7 v18.2,57.7
PB5  (via drill 0.35)
  Top 0.152: v23.87,42 23.87,42.27 MCU1.17 24.5,44.18 24.5,45.7 17.8,52.4 17.8,57.3 17.6,57.5 17.6,57.9 17.8,58.1 v17.8,58.6 17.8,59.07 17.57,59.3 17.57,59.75 17.79,59.97 17.79,62.49 21.4,66.1 21.4,68.37 FH1.18 | v26.4,35.3 25.6,35.3 23.5,33.2 23.5,30.37 22.43,29.3 EBYTE.18_SCK
  Bottom 0.152: v23.87,42 24.27,42 26.1,40.17 26.1,35.6 v26.4,35.3 | ICSP.3 5.6,58.03 5.97,58.4 17.6,58.4 v17.8,58.6
PB6  (via drill 0.35)
  Top 0.152: v18.2,39.8 18.2,39.19 16.85,37.85 MCU1.7 | v11,40.37 11.6,40.97 11.6,59.6 5.8,65.4 4.11,65.4 2.48,67.03 FH1.1
  Top 0.508: MCU1.7 16.2,36.99 Y1.3
  Bottom 0.152: v18.2,39.8 17.63,40.37 v11,40.37
PB7  (via drill 0.35)
  Top 0.152: MCU1.8 17.61,37.09 19.1,38.58 v19.1,39.8 | v11,41.2 11.2,41.4 11.2,59.5 5.93,64.77 v5.2,64.77
  Bottom 0.152: v11,41.2 11.4,40.8 18.1,40.8 v19.1,39.8 | FH1.2 3.6,68.25 3.6,66.37 v5.2,64.77
PC0  (via drill 0.55, 0.65)
  Top 0.152: FH1.13 16.4,65.91 16.4,52.3 20.85,47.85 20.85,47.32
  Top 0.508: MCU1.23 20.85,47.32 v20.9,47.32
  Top 0.61: v24,62.1 23,61.1 R2.2
  Bottom 0.61: v20.9,47.32 18,50.22 18,55.24 24,61.24 v24,62.1
PC1
  Top 0.152: FH1.14 16.3,68.35 16.3,66.3 16,66 16,50.14 MCU1.24
PC2
  Top 0.152: FH1.11 15.6,66.41 15.6,48.67 MCU1.25
PC3
  Top 0.152: MCU1.26 15.38,47.78 15.21,47.95 15.21,65.1 13.8,66.51 13.8,68.39 FH1.12
PC4
  Top 0.152: MCU1.27 14.8,47.21 14.8,64.67 FH1.9
  Bottom 0.508: R12.2 13.7,65.77 FH1.9
PC5
  Top 0.152: FH1.10 11.2,68.33 11.2,66.6 14.4,63.4 14.4,46.49 MCU1.28
  Bottom 0.508: FH1.10 11.2,68.33 11.2,64.55 R11.2
PC6  (via drill 0.35, 0.55)
  Top 0.152: MCU1.29 14.22,45.52 v14.2,45.5 14,45.7 14,63.33 10.3,67.03 FH1.7
  Top 0.508: R10.2 7.5,52.85 D1.A 8.14,55.14 ICSP.5 | v9.3,50.5 7.47,50.5 SW1.1
  Top 1.27: SW1.3 SW1.1 R10.2
  Bottom 0.508: v9.3,50.5 9.25,50.45 v14.2,45.5 14.25,45.45 C17.1
PD0  (via drill 0.35)
  Top 0.152: v28.4,36.2 27.8,35.6 27.8,34.9 28.35,34.35 RX.C 31.05,33.3 33.15,33.3 R8.2 36,32.35 R9.1 | v18.4,43.5 15.13,43.5 MCU1.30 13.6,45.03 13.6,63.2 11.1,65.7 9.5,65.7 8.7,66.5 8.7,68.37 FH1.8
  Bottom 0.152: v28.4,36.2 26.9,37.7 26.9,40.6 24,43.51 v18.41,43.51 v18.4,43.5
PD1  (via drill 0.35)
  Top 0.152: R6.2 35.85,38 34,38 33.4,37.4 31.15,37.4 TX.C 29.35,36.25 v28.4,35.3 | v20.1,42.8 14.68,42.8 MCU1.31 13.2,44.28 13.2,60.09 7.36,65.93 FH1.5
  Bottom 0.152: v28.4,35.3 26.5,37.2 26.5,40.4 24.1,42.8 v20.1,42.8
PD2  (via drill 0.35)
  Top 0.152: FH1.6 6.1,68.31 6.1,66.6 12.8,59.9 12.8,43.57 MCU1.32 14.27,42.1 v16.4,42.1 | EBYTE.13_DIO1 35.11,29.29 34.59,29.8 32.8,29.8 31.99,30.61 27.59,30.61 v26.9,31.3
  Bottom 0.152: v16.4,42.1 18.7,42.1 22.5,38.3 22.5,33.8 25,31.3 v26.9,31.3
PD3  (via drill 0.35)
  Top 0.152: MCU1.1 v12.8,41.7 12.75,41.75 | 12.75,41.75 | 12.75,41.75 12.4,42.1 12.4,59.85 5.22,67.03 FH1.3 | v14.8,28.8 14.8,28.9 v12.1,31.6
  Bottom 0.152: R13.1 26.85,2.95 14.8,15 v14.8,28.8 | v12.1,31.6 12.1,34.2 10.3,36 10.3,41.4 10.7,41.8 12.7,41.8 v12.8,41.7
PD4
  Top 0.152: MCU1.2 13.53,40 13.1,40 12,41.1 12,59.7 5.9,65.8 4.35,65.8 3.6,66.55 3.6,68.35 FH1.4
PD5
  Top 0.152: MCU1.9 20.17,36.2 24.9,36.2 27.7,39 27.7,46.46 21.2,52.96 21.2,61.8 23,63.6 26.1,63.6 27.6,65.1 29.99,65.1 31.5,66.61 31.5,68.31 FH1.26
PD6  (via drill 0.35)
  Top 0.152: MCU1.10 20.58,36.9 v21.1,36.9 25.1,36.9 27.3,39.1 27.3,46.4 20.8,52.9 20.8,61.9 22.9,64 26,64 27.5,65.5 29.4,65.5 30.22,66.32 FH1.23 | EBYTE.6_RXEN 24.94,2.84 24.1,2 v22.3,2
  Bottom 0.152: v21.1,36.9 21.1,35.1 19,33 15.3,33 12.3,30 12.3,12 v22.3,2
PD7  (via drill 0.35)
  Top 0.152: FH1.24 29,68.35 29,66.6 28.3,65.9 27.4,65.9 25.9,64.4 22.8,64.4 20.4,62 20.4,52.8 26.9,46.3 26.9,39.2 25.2,37.5 v21.9,37.5 21.13,37.5 MCU1.11 | EBYTE.7_TXEN 27.48,2.88 26.6,2 v25,2
  Bottom 0.152: v21.9,37.5 21.9,34 19,31.1 15.2,31.1 13.5,29.4 13.5,13.5 v25,2
RX
  Top 0.152: MX2.RX 36.4,36.25 R6.1
RX_AN
  Top 0.152: R7.1 31.9,32.25 RX.A
TX
  Top 0.152: MX2.TX 36.7,33.75 R9.2
TX_AN
  Top 0.152: R5.1 TX.A
VIN
  Top 1.27: FH1.29 37.84,65.84 35.48,63.48 L1.1 37.3,61 38.59,62.29 MX1.2

### Text on the board
bNames: LCOM-V2 | 02/04/2021